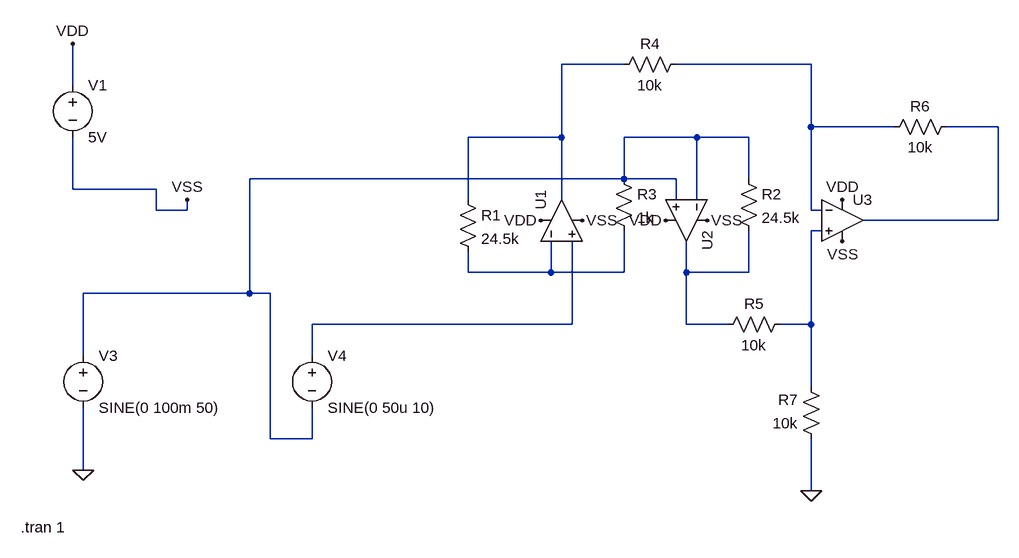
[diagram p0: schematic INADraft1.asc]
INADraft1.asc, the LTspice schematic file:
Version 4.1
SHEET 1 880 680
WIRE 128 -128 32 -128
WIRE 416 -128 208 -128
WIRE -720 -96 -720 -160
WIRE 416 -32 416 -128
WIRE 544 -32 416 -32
WIRE 704 -32 624 -32
WIRE 32 -16 32 -128
WIRE 32 -16 -112 -16
WIRE 240 -16 128 -16
WIRE 320 -16 240 -16
WIRE 128 48 128 -16
WIRE 128 48 -448 48
WIRE 208 48 128 48
WIRE 320 48 320 -16
WIRE -720 64 -720 -16
WIRE -592 64 -720 64
WIRE -112 80 -112 -16
WIRE 32 80 32 -16
WIRE 208 80 208 48
WIRE 240 80 240 -16
WIRE -592 96 -592 64
WIRE -544 96 -544 80
WIRE -544 96 -592 96
WIRE 416 96 416 -32
WIRE 432 96 416 96
WIRE 704 112 704 -32
WIRE 704 112 496 112
WIRE 432 128 416 128
WIRE -112 192 -112 160
WIRE 16 192 16 144
WIRE 16 192 -112 192
WIRE 128 192 128 128
WIRE 128 192 16 192
WIRE 224 192 224 144
WIRE 320 192 320 128
WIRE 320 192 224 192
WIRE -448 224 -448 48
WIRE -448 224 -704 224
WIRE -416 224 -448 224
WIRE 48 272 48 144
WIRE 48 272 -352 272
WIRE 224 272 224 192
WIRE 288 272 224 272
WIRE 416 272 416 128
WIRE 416 272 368 272
WIRE -704 320 -704 224
WIRE -352 320 -352 272
WIRE 416 368 416 272
WIRE -416 448 -416 224
WIRE -352 448 -352 400
WIRE -352 448 -416 448
WIRE -704 496 -704 400
WIRE 416 528 416 448
FLAG 416 528 0
FLAG -720 -160 VDD
FLAG -544 80 VSS
FLAG 0 112 VDD
FLAG 192 112 VDD
FLAG 464 80 VDD
FLAG 64 112 VSS
FLAG 256 112 VSS
FLAG 464 144 VSS
FLAG -704 496 0
DATAFLAG -720 64 ""
DATAFLAG 592 112 ""
DATAFLAG 576 112 ""
SYMBOL OpAmps\\UniversalOpAmp2 32 112 R270
SYMATTR InstName U1
SYMBOL OpAmps\\UniversalOpAmp2 224 112 R90
SYMATTR InstName U2
SYMBOL OpAmps\\UniversalOpAmp2 464 112 R0
SYMATTR InstName U3
SYMBOL res -128 64 R0
SYMATTR InstName R1
SYMATTR Value 24.5k
SYMBOL res 304 32 R0
SYMATTR InstName R2
SYMATTR Value 24.5k
SYMBOL res 112 32 R0
SYMATTR InstName R3
SYMATTR Value 1k
SYMBOL res 224 -144 R90
WINDOW 0 0 56 VBottom 2
WINDOW 3 32 56 VTop 2
SYMATTR InstName R4
SYMATTR Value 10k
SYMBOL res 384 256 R90
WINDOW 0 0 56 VBottom 2
WINDOW 3 32 56 VTop 2
SYMATTR InstName R5
SYMATTR Value 10k
SYMBOL res 640 -48 R90
WINDOW 0 0 56 VBottom 2
WINDOW 3 32 56 VTop 2
SYMATTR InstName R6
SYMATTR Value 10k
SYMBOL res 432 464 R180
WINDOW 0 36 76 Left 2
WINDOW 3 36 40 Left 2
SYMATTR InstName R7
SYMATTR Value 10k
SYMBOL voltage -720 -112 R0
SYMATTR InstName V1
SYMATTR Value 5V
SYMBOL voltage -704 304 R0
WINDOW 123 0 0 Left 0
WINDOW 39 0 0 Left 0
SYMATTR InstName V3
SYMATTR Value SINE(0 100m 50)
SYMBOL voltage -352 304 R0
WINDOW 123 0 0 Left 0
WINDOW 39 0 0 Left 0
SYMATTR InstName V4
SYMATTR Value SINE(0 50u 10)
TEXT -800 584 Left 2 !.tran 1

The netlist it stands for:
* INADraft1.asc
X§U1 N008 N006 VDD VSS N001 level2 Avol=1Meg GBW=10Meg Slew=10Meg Ilimit=25m Rail=0 Vos=0 En=0 Enk=0 In=0 Ink=0 Rin=500Meg  ; pins In+ In- V+ V- OUT
X§U2 N004 N004 VSS VDD N007 level2 Avol=1Meg GBW=10Meg Slew=10Meg Ilimit=25m Rail=0 Vos=0 En=0 Enk=0 In=0 Ink=0 Rin=500Meg  ; pins In+ In- V+ V- OUT
X§U3 N005 N002 VDD VSS N003 level2 Avol=1Meg GBW=10Meg Slew=10Meg Ilimit=25m Rail=0 Vos=0 En=0 Enk=0 In=0 Ink=0 Rin=500Meg  ; pins In+ In- V+ V- OUT
R1 N001 N006 24.5k
R2 N004 N007 24.5k
R3 N004 N006 1k
R4 N002 N001 10k
R5 N005 N007 10k
R6 N003 N002 10k
R7 0 N005 10k
V1 VDD VSS 5V
V3 N004 0 SINE(0 100m 50)
V4 N008 N004 SINE(0 50u 10)
.tran 1
.lib UniversalOpAmp2.lib
.backanno
.end